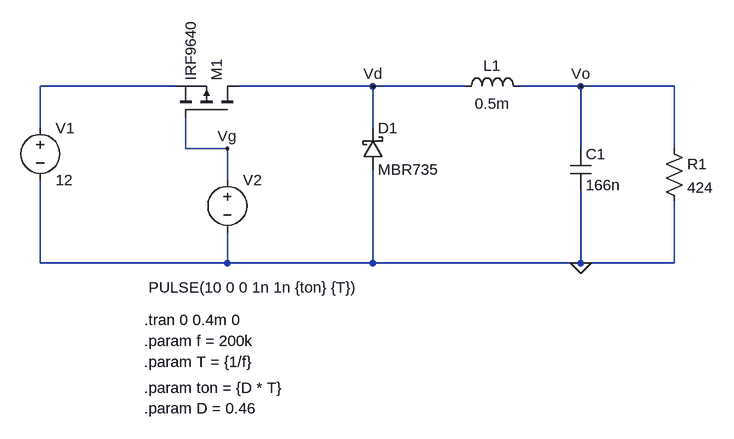
[diagram p0: schematic Regulador_buck.asc]
Regulador_buck.asc, the LTspice schematic file:
Version 4
SHEET 1 1092 680
WIRE 240 48 32 48
WIRE 544 48 336 48
WIRE 688 48 544 48
WIRE 864 48 768 48
WIRE 1008 48 864 48
WIRE 32 112 32 48
WIRE 544 112 544 48
WIRE 256 144 256 96
WIRE 320 144 256 144
WIRE 864 144 864 48
WIRE 1008 144 1008 48
WIRE 320 192 320 144
WIRE 32 320 32 192
WIRE 320 320 320 272
WIRE 320 320 32 320
WIRE 544 320 544 176
WIRE 544 320 320 320
WIRE 864 320 864 208
WIRE 864 320 544 320
WIRE 1008 320 1008 224
WIRE 1008 320 864 320
FLAG 864 320 0
FLAG 864 48 Vo
FLAG 320 144 Vg
FLAG 544 48 Vd
SYMBOL voltage 32 96 R0
WINDOW 123 0 0 Left 0
WINDOW 39 0 0 Left 0
SYMATTR InstName V1
SYMATTR Value 12
SYMBOL voltage 320 176 R0
WINDOW 3 -121 182 Left 2
WINDOW 123 0 0 Left 0
WINDOW 39 0 0 Left 0
SYMATTR Value PULSE(10 0 0 1n 1n {ton} {T})
SYMATTR InstName V2
SYMBOL schottky 528 176 M180
WINDOW 0 24 64 Left 2
WINDOW 3 24 0 Left 2
SYMATTR InstName D1
SYMATTR Value MBR735
SYMATTR Description Diode
SYMATTR Type diode
SYMBOL ind 672 64 R270
WINDOW 0 32 56 VTop 2
WINDOW 3 5 56 VBottom 2
SYMATTR InstName L1
SYMATTR Value 0.5m
SYMBOL cap 848 144 R0
SYMATTR InstName C1
SYMATTR Value 166n
SYMBOL pmos 336 96 M270
SYMATTR InstName M1
SYMATTR Value IRF9640
SYMBOL res 992 128 R0
SYMATTR InstName R1
SYMATTR Value 424
TEXT 192 408 Left 2 !.tran 0 0.4m 0
TEXT 192 440 Left 2 !.param f = 200k
TEXT 192 472 Left 2 !.param T = {1/f}
TEXT 192 512 Left 2 !.param ton = {D * T}
TEXT 192 544 Left 2 !.param D = 0.46

The netlist it stands for:
* Regulador_buck.asc
V1 N001 0 12
V2 Vg 0 PULSE(10 0 0 1n 1n {ton} {T})
D1 0 Vd MBR735
L1 Vd Vo 0.5m
C1 Vo 0 166n
M1 Vd Vg N001 N001 IRF9640
R1 Vo 0 424
.model D D
.lib standard.dio
.model NMOS NMOS
.model PMOS PMOS
.lib standard.mos
.tran 0 0.4m 0
.param f = 200k
.param T = {1/f}
.param ton = {D * T}
.param D = 0.46
.backanno
.end

* Results of the author's LTspice run, read from the files saved beside the schematic
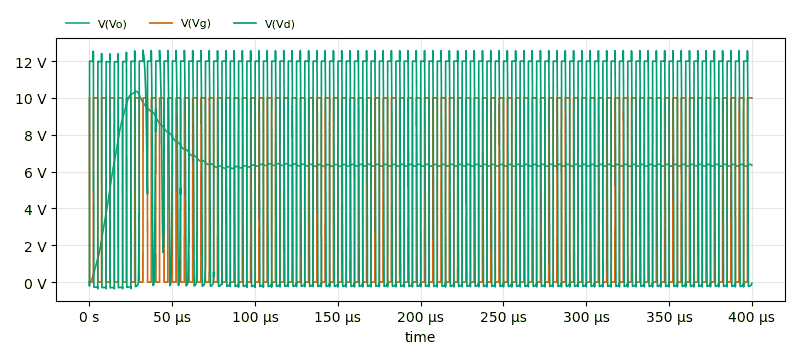
[diagram p1: Transient Analysis of Regulador_buck.asc, plotted from the saved traces]
* Transient Analysis, 1 run:
*   V(Vo): min 0 V, max 10.36 V, average 6.481 V, rms 6.587 V, last 6.349 V
*   V(Vg): min 0 V, max 10 V, average 5.398 V, rms 7.347 V, last 10 V
*   V(Vd): min -363.2 mV, max 12.58 V, average 6.48 V, rms 8.738 V, last -63.05 mV